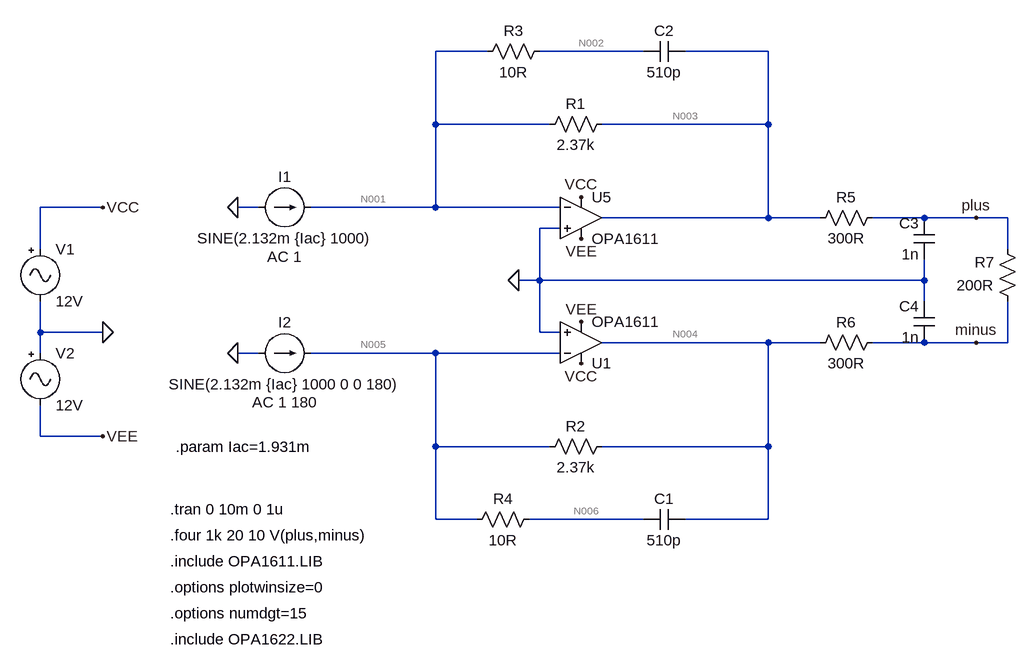
[diagram p0: schematic es9038OriginalOut.asc]
es9038OriginalOut.asc, the LTspice schematic file:
Version 4
SHEET 1 2148 1200
WIRE 624 -160 544 -160
WIRE 864 -160 704 -160
WIRE 1056 -160 928 -160
WIRE 544 -48 544 -160
WIRE 720 -48 544 -48
WIRE 1056 -48 1056 -160
WIRE 1056 -48 800 -48
WIRE 32 80 -64 80
WIRE 272 80 240 80
WIRE 544 80 544 -48
WIRE 544 80 352 80
WIRE 736 80 544 80
WIRE 1056 96 1056 -48
WIRE 1056 96 800 96
WIRE 1136 96 1056 96
WIRE 1296 96 1216 96
WIRE 1376 96 1296 96
WIRE 1424 96 1376 96
WIRE 736 112 704 112
WIRE -64 144 -64 80
WIRE 1424 144 1424 96
WIRE 704 192 704 112
WIRE 704 192 672 192
WIRE 1296 192 1296 160
WIRE 1296 192 704 192
WIRE 1296 224 1296 192
WIRE -64 272 -64 224
WIRE 32 272 -64 272
WIRE 704 272 704 192
WIRE 736 272 704 272
WIRE 1056 288 800 288
WIRE 1136 288 1056 288
WIRE 1296 288 1216 288
WIRE 1376 288 1296 288
WIRE 1424 288 1424 224
WIRE 1424 288 1376 288
WIRE -64 304 -64 272
WIRE 272 304 240 304
WIRE 544 304 352 304
WIRE 736 304 544 304
WIRE -64 432 -64 384
WIRE 32 432 -64 432
WIRE 544 448 544 304
WIRE 720 448 544 448
WIRE 1056 448 1056 288
WIRE 1056 448 800 448
WIRE 544 560 544 448
WIRE 608 560 544 560
WIRE 864 560 688 560
WIRE 1056 560 1056 448
WIRE 1056 560 928 560
FLAG 240 80 0
FLAG 240 304 0
FLAG 32 272 0
FLAG 32 80 VCC
FLAG 32 432 VEE
FLAG 672 192 0
FLAG 768 64 VCC
FLAG 768 320 VCC
FLAG 768 256 VEE
FLAG 768 128 VEE
FLAG 1376 96 plus
FLAG 1376 288 minus
SYMBOL current 272 80 R270
WINDOW 0 32 40 VTop 2
WINDOW 3 -32 40 VBottom 2
WINDOW 123 -60 40 VBottom 2
WINDOW 39 0 0 Left 0
SYMATTR InstName I1
SYMATTR Value SINE(2.132m {Iac} 1000)
SYMATTR Value2 AC 1
SYMBOL current 272 304 R270
WINDOW 0 32 40 VTop 2
WINDOW 3 -32 40 VBottom 2
WINDOW 123 -60 40 VBottom 2
WINDOW 39 0 0 Left 0
SYMATTR InstName I2
SYMATTR Value SINE(2.132m {Iac} 1000 0 0 180)
SYMATTR Value2 AC 1 180
SYMBOL Misc\\signal -64 128 R0
WINDOW 123 0 0 Left 0
WINDOW 39 0 0 Left 0
SYMATTR InstName V1
SYMATTR Value 12V
SYMBOL Misc\\signal -64 288 R0
WINDOW 123 0 0 Left 0
WINDOW 39 0 0 Left 0
SYMATTR InstName V2
SYMATTR Value 12V
SYMBOL res 816 -64 R90
WINDOW 0 0 56 VBottom 2
WINDOW 3 32 56 VTop 2
SYMATTR InstName R1
SYMATTR Value 2.37k
SYMBOL res 816 432 R90
WINDOW 0 0 56 VBottom 2
WINDOW 3 32 56 VTop 2
SYMATTR InstName R2
SYMATTR Value 2.37k
SYMBOL cap 928 544 R90
WINDOW 0 0 32 VBottom 2
WINDOW 3 32 32 VTop 2
SYMATTR InstName C1
SYMATTR Value 510p
SYMBOL cap 928 -176 R90
WINDOW 0 0 32 VBottom 2
WINDOW 3 32 32 VTop 2
SYMATTR InstName C2
SYMATTR Value 510p
SYMBOL OpAmps\\opamp2 768 32 R0
SYMATTR InstName U5
SYMATTR Value OPA1611
SYMATTR SpiceModel OPA1611
SYMBOL OpAmps\\opamp2 768 352 M180
SYMATTR InstName U1
SYMATTR Value OPA1611
SYMATTR SpiceModel OPA1611
SYMBOL res 720 -176 R90
WINDOW 0 0 56 VBottom 2
WINDOW 3 32 56 VTop 2
SYMATTR InstName R3
SYMATTR Value 10R
SYMBOL res 704 544 R90
WINDOW 0 0 56 VBottom 2
WINDOW 3 32 56 VTop 2
SYMATTR InstName R4
SYMATTR Value 10R
SYMBOL cap 1312 160 R180
WINDOW 0 24 56 Left 2
WINDOW 3 24 8 Left 2
SYMATTR InstName C3
SYMATTR Value 1n
SYMBOL cap 1312 288 R180
WINDOW 0 24 56 Left 2
WINDOW 3 24 8 Left 2
SYMATTR InstName C4
SYMATTR Value 1n
SYMBOL res 1232 80 R90
WINDOW 0 0 56 VBottom 2
WINDOW 3 32 56 VTop 2
SYMATTR InstName R5
SYMATTR Value 300R
SYMBOL res 1232 272 R90
WINDOW 0 0 56 VBottom 2
WINDOW 3 32 56 VTop 2
SYMATTR InstName R6
SYMATTR Value 300R
SYMBOL res 1440 240 R180
WINDOW 0 36 76 Left 2
WINDOW 3 36 40 Left 2
SYMATTR InstName R7
SYMATTR Value 200R
TEXT 136 544 Left 2 !.tran 0 10m 0 1u
TEXT 136 584 Left 2 !.four 1k 20 10 V(plus,minus)
TEXT 136 624 Left 2 !.include OPA1611.LIB
TEXT 136 664 Left 2 !.options plotwinsize=0
TEXT 136 704 Left 2 !.options numdgt=15
TEXT 144 448 Left 2 !.param Iac=1.931m
TEXT 136 744 Left 2 !.include OPA1622.LIB

The netlist it stands for:
* es9038OriginalOut.asc
I1 0 N001 SINE(2.132m {Iac} 1000) AC 1
I2 0 N005 SINE(2.132m {Iac} 1000 0 0 180) AC 1 180
V1 VCC 0 12V
V2 0 VEE 12V
R1 N003 N001 2.37k
R2 N004 N005 2.37k
C1 N004 N006 510p
C2 N003 N002 510p
XU5 0 N001 VCC VEE N003 OPA1611 OPA1611  ; pins In+ In- V+ V- OUT
XU1 0 N005 VCC VEE N004 OPA1611 OPA1611  ; pins In+ In- V+ V- OUT
R3 N002 N001 10R
R4 N006 N005 10R
C3 0 plus 1n
C4 minus 0 1n
R5 plus N003 300R
R6 minus N004 300R
R7 minus plus 200R
.tran 0 10m 0 1u
.four 1k 20 10 V(plus,minus)
.include OPA1611.LIB
.options plotwinsize=0
.options numdgt=15
.param Iac=1.931m
.include OPA1622.LIB
.backanno
.end

* Results of the author's LTspice run, read from the files saved beside the schematic
* Operating Point, zero values left out:
*   V(n001) = 110.7 µV
*   V(n005) = 110.7 µV
*   V(vcc) = 12 V
*   V(vee) = -12 V
*   V(n003) = -5.053 V
*   V(n004) = -5.053 V
*   V(n006) = 110.7 µV
*   V(n002) = 110.7 µV
*   V(plus) = -5.053 V
*   V(minus) = -5.053 V
*   I(I2) = 2.132 mA
*   I(I1) = 2.132 mA
*   I(R2) = -2.132 mA
*   I(R1) = -2.132 mA
*   I(V2) = -11.46 mA
*   I(V1) = -7.2 mA
*   Ix(u5:IN+) = 60 nA
*   Ix(u5:IN-) = 35 nA
*   Ix(u5:VCC) = 3.6 mA
*   Ix(u5:VEE) = -5.732 mA
*   Ix(u5:OUT) = 2.132 mA
*   Ix(u1:IN+) = 60 nA
*   Ix(u1:IN-) = 35 nA
*   Ix(u1:VCC) = 3.6 mA
*   Ix(u1:VEE) = -5.732 mA
*   Ix(u1:OUT) = 2.132 mA
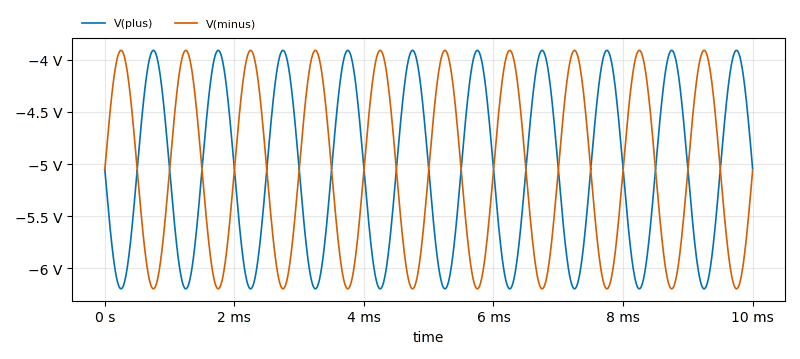
[diagram p1: Transient Analysis of es9038OriginalOut.asc, plotted from the saved traces]
* Transient Analysis, 1 run:
*   V(plus): min -6.197 V, max -3.909 V, average -5.053 V, rms 5.117 V, last -5.043 V
*   V(minus): min -6.197 V, max -3.909 V, average -5.053 V, rms 5.117 V, last -5.062 V
* From the log:
*   N-Period=10
*   Fourier components of V(plus,minus)
*   DC component:-2.40922e-006
*   Harmonic  Frequency   Fourier   Normalized   Phase    Normalized
*    Number     [Hz]     Component   Component  [degree]  Phase [deg]
*       1     1.000e+03  2.288e+00  1.000e+00    179.54°      0.00°
*       2     2.000e+03  4.834e-06  2.113e-06    -90.89°   -270.43°
*       3     3.000e+03  4.834e-06  2.113e-06    -91.35°   -270.89°
*       4     4.000e+03  4.833e-06  2.112e-06    -91.80°   -271.34°
*       5     5.000e+03  4.832e-06  2.112e-06    -92.26°   -271.79°
*       6     6.000e+03  4.830e-06  2.111e-06    -92.71°   -272.25°
*       7     7.000e+03  4.828e-06  2.110e-06    -93.16°   -272.70°
*       8     8.000e+03  4.826e-06  2.109e-06    -93.61°   -273.15°
*       9     9.000e+03  4.824e-06  2.108e-06    -94.06°   -273.60°
*      10     1.000e+04  4.822e-06  2.107e-06    -94.51°   -274.05°
*      11     1.100e+04  4.819e-06  2.106e-06    -94.96°   -274.50°
*      12     1.200e+04  4.816e-06  2.105e-06    -95.41°   -274.95°
*      13     1.300e+04  4.812e-06  2.103e-06    -95.86°   -275.40°
*      14     1.400e+04  4.809e-06  2.102e-06    -96.31°   -275.85°
*      15     1.500e+04  4.805e-06  2.100e-06    -96.76°   -276.30°
*      16     1.600e+04  4.801e-06  2.098e-06    -97.21°   -276.74°
*      17     1.700e+04  4.796e-06  2.096e-06    -97.65°   -277.19°
*      18     1.800e+04  4.792e-06  2.094e-06    -98.10°   -277.63°
*      19     1.900e+04  4.787e-06  2.092e-06    -98.54°   -278.08°
*      20     2.000e+04  4.782e-06  2.090e-06    -98.99°   -278.52°
*   Total Harmonic Distortion: 0.000917%(0.009292%)